# EAGLE schematic LedDriver (EAGLE 9.6.2)
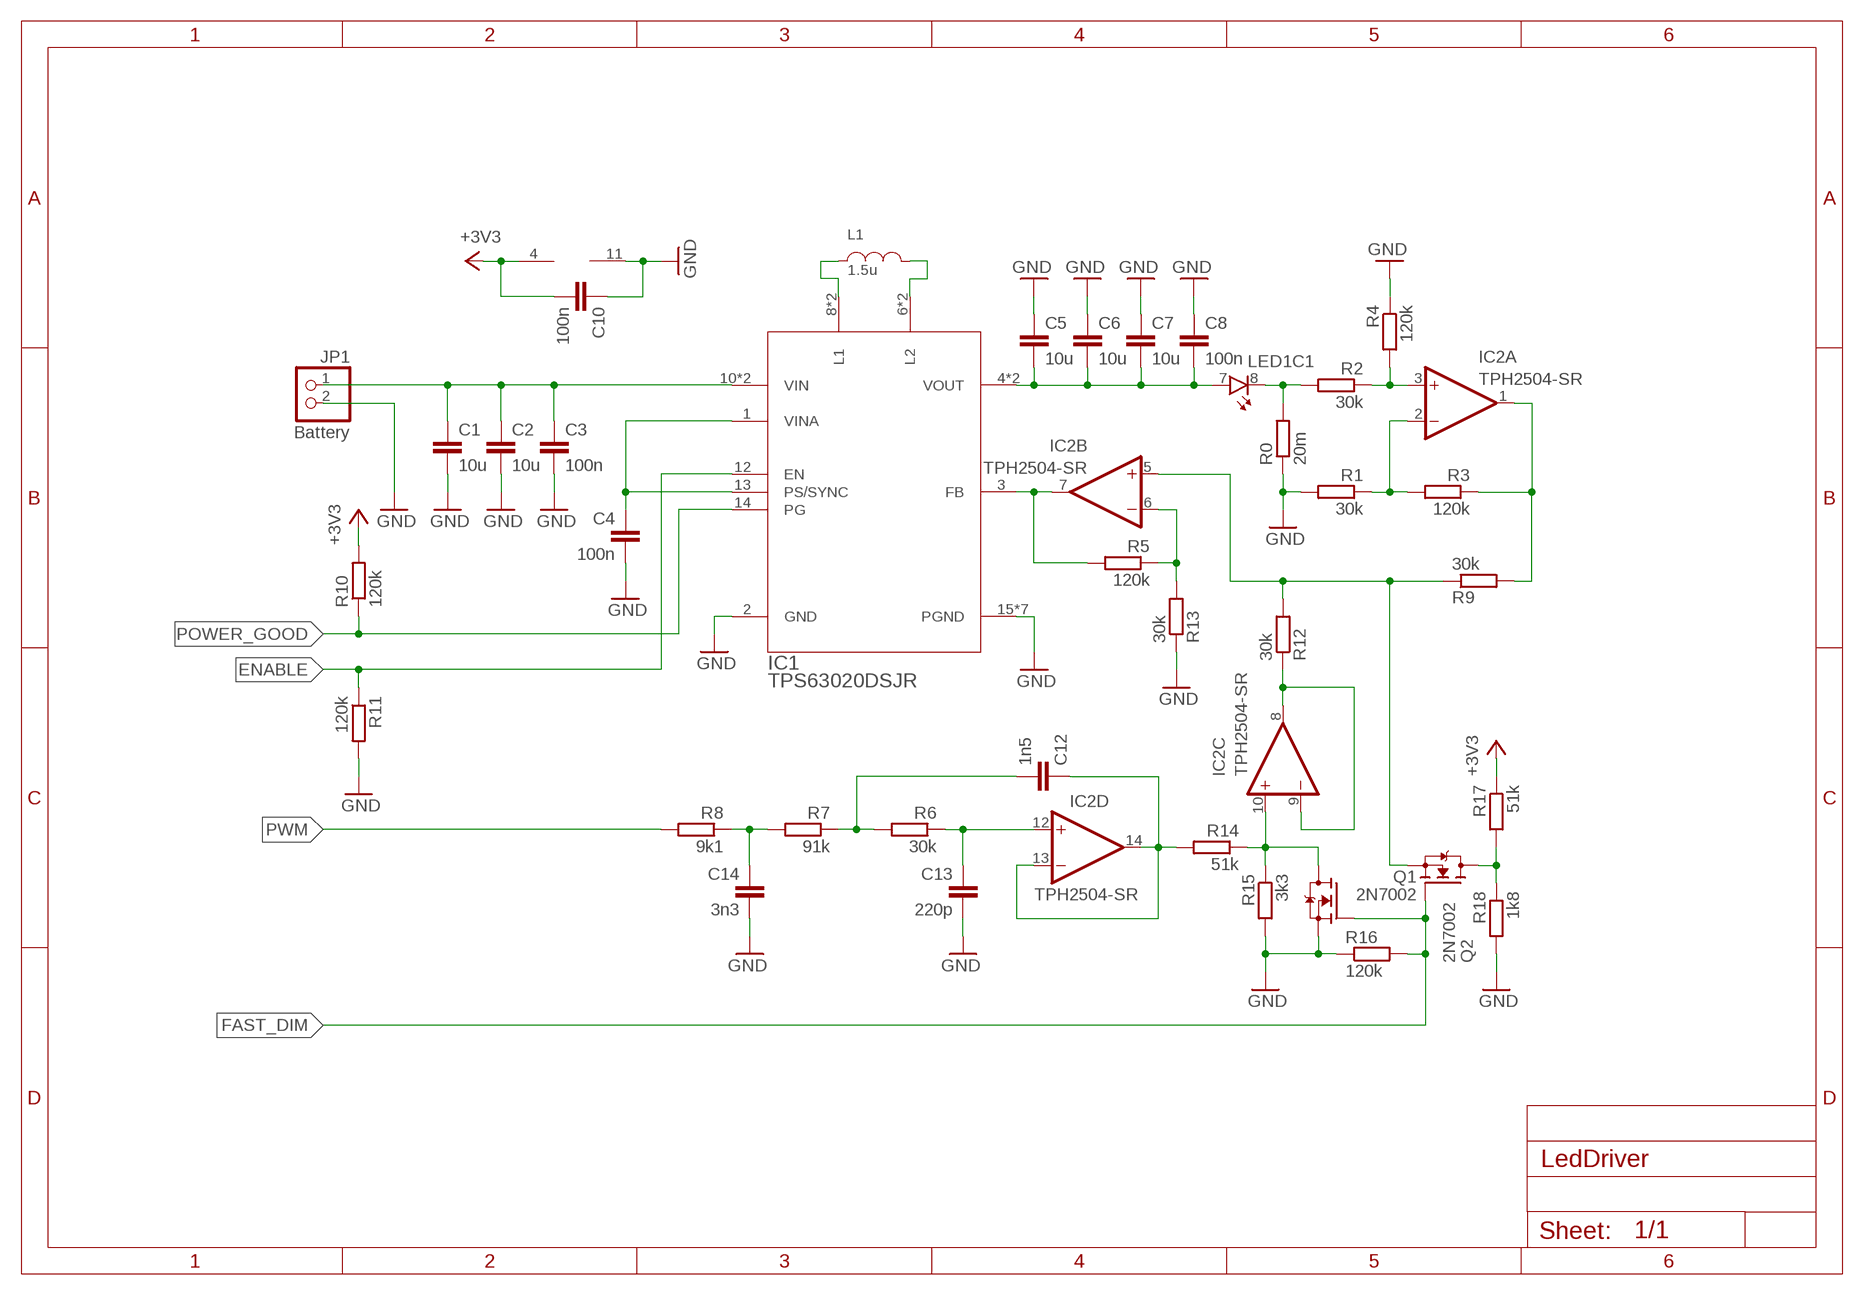
[diagram p0: schematic, sheet 1]

## Parts
C1  10u  C-EUC0603  [C0603]
C2  10u  C-EUC0603  [C0603]
C3  100n  C-EUC0603  [C0603]
C4  100n  C-EUC0603  [C0603]
C5  10u  C-EUC0603  [C0603]
C6  10u  C-EUC0603  [C0603]
C7  10u  C-EUC0603  [C0603]
C8  100n  C-EUC0603  [C0603]
C10  100n  C-EUC0603  [C0603]
C12  1n5  C-EUC0603  [C0603]
C13  220p  C-EUC0603  [C0603]
C14  3n3  C-EUC0603  [C0603]
IC1  TPS63020DSJR  [DSJ14_2P85X1P58]
IC2  TPH2504-SR  MCP604SL  [SO14]
JP1  Battery  PINHD-1X2  [1X02]
L1  1.5u  L5X5MM  [5X5MM]
LED1  ACULEDVHL-RGBY  [ACULEDVHL]
Q1  2N7002  N-MOSFET-SOT23-GSD  [SOT23]
Q2  2N7002  N-MOSFET-SOT23-GSD  [SOT23]
R0  20m  R-EU_R0805  [R0805]
R1  30k  R-EU_R0603  [R0603]
R2  30k  R-EU_R0603  [R0603]
R3  120k  R-EU_R0603  [R0603]
R4  120k  R-EU_R0603  [R0603]
R5  120k  R-EU_R0603  [R0603]
R6  30k  R-EU_R0603  [R0603]
R7  91k  R-EU_R0603  [R0603]
R8  9k1  R-EU_R0603  [R0603]
R9  30k  R-EU_R0603  [R0603]
R10  120k  R-EU_R0402  [R0402]
R11  120k  R-EU_R0402  [R0402]
R12  30k  R-EU_R0603  [R0603]
R13  30k  R-EU_R0603  [R0603]
R14  51k  R-EU_R0603  [R0603]
R15  3k3  R-EU_R0603  [R0603]
R16  120k  R-EU_R0402  [R0402]
R17  51k  R-EU_R0603  [R0603]
R18  1k8  R-EU_R0603  [R0603]

## Nets
+3V3: C10.2 IC2.4(P:V+) R10.2 R17.1
DRIVER_LOGIC_PWR: C4.1 IC1.1(VINA) IC1.13(PS/SYNC)
ENABLE: IC1.12(EN) R11.1
FAST_DIM: Q1.1(G) Q2.1(G) R16.2
FB: IC1.3(FB) IC2.7(B:OUT) R5.2
GND: C1.2 C2.2 C3.2 C4.2 C5.1 C6.1 C7.1 C8.1 C10.1 C13.2 C14.2 IC1.2(GND) IC1.15(PGND) IC1.V(PGND) IC1.V_1(PGND) IC1.V_2(PGND) IC1.V_3(PGND) IC1.V_4(PGND) IC1.V_5(PGND) IC2.11(P:V-) JP1.2 Q1.2(S) R0.1 R1.2 R4.1 R11.2 R13.1 R15.2 R16.1 R18.2
L1: IC1.8(L1) IC1.9(L1) L1.1
L2: IC1.6(L2) IC1.7(L2) L1.2
LED_A: LED1.8(C1:C) R0.2 R2.2
LED_C: C5.2 C6.2 C7.2 C8.2 IC1.4(VOUT) IC1.5(VOUT) LED1.7(C1:A)
N$1: IC2.3(A:+IN) R2.1 R4.2
N$2: C14.1 R7.2 R8.1
N$3: IC2.5(B:+IN) Q2.2(S) R9.1 R12.2
N$4: IC2.6(B:-IN) R5.1 R13.2
N$5: C12.2 R6.2 R7.1
N$6: IC2.1(A:OUT) R3.1 R9.2
N$7: C13.1 IC2.12(D:+IN) R6.1
N$8: C12.1 IC2.13(D:-IN) IC2.14(D:OUT) R14.2
N$9: IC2.10(C:+IN) Q1.3(D) R14.1 R15.1
N$10: IC2.8(C:OUT) IC2.9(C:-IN) R12.1
N$12: Q2.3(D) R17.2 R18.1
POWER_GOOD: IC1.14(PG) R10.1
PWM: R8.2
VA: IC2.2(A:-IN) R1.1 R3.2
VIN: C1.1 C2.1 C3.1 IC1.10(VIN) IC1.11(VIN) JP1.1
Unconnected: LED1.1(C4:A) LED1.2(C4:C) LED1.3(C3:A) LED1.4(C3:C) LED1.5(C2:A) LED1.6(C2:C)

## Library data of the parts
C1 C2 C5-C7 = rcl_upravena:C-EU: CAPACITOR, European symbol; LCSC: C96446
C3 C4 C8 C10 = rcl_upravena:C-EU: CAPACITOR, European symbol; LCSC: C14663
C12 = rcl_upravena:C-EU: CAPACITOR, European symbol; LCSC: C1595
C13 = rcl_upravena:C-EU: CAPACITOR, European symbol; LCSC: C1603
C14 = rcl_upravena:C-EU: CAPACITOR, European symbol; LCSC: C1613
IC1 = TPS63020:TPS63020DSJR; DATASHEET_URL: http://www.ti.com/lit/gpn/TPS63020; DESCRIPTION: High Efficiency Single Inductor Buck-Boost Converter with 4A Switch; FAMILY_NAME: BUCK-BOOST REGULATOR; GENERIC_PART_NUMBER: TPS63020; INDUSTRY_STD_PKG_TYPE: VSON; LCSC: C15483; MANUFACTURER: Texas Instruments; MANUFACTURER_PART_NUMBER: TPS63020DSJR; PACKAGE_DESIGNATOR: DSJ; PIN_COUNT: 14; VENDOR: Texas Instruments
IC2 = linear_upravena:MCP604: Quad Op Amp 2.7V to 6.0V Single Supply CMOS Source: http://ww1.microchip.com/downloads/en/DeviceDoc/21314g.pdf; LCSC: C115918
JP1 = pinhead:PINHD-1X2: PIN HEADER
L1 = inductors:L; LCSC: C408344
LED1 = led:ACULEDVHL: ACULED® VHL Standard Monochromatic and Multi-Colored Four-Chip LED Source: http://optoelectronics.perkinelmer.com/content/Datasheets/DTS_ACULEDVHL.pdf
Q1 Q2 = transistors:N-MOSFET; LCSC: C8545
R0 = rcl_upravena:R-EU_: RESISTOR, European symbol; LCSC: C92740
R1 R2 R6 R9 R12 R13 = rcl_upravena:R-EU_: RESISTOR, European symbol; LCSC: C22984
R3-R5 R10 R11 R16 = rcl_upravena:R-EU_: RESISTOR, European symbol; LCSC: C25808
R7 = rcl_upravena:R-EU_: RESISTOR, European symbol; LCSC: C23265
R8 = rcl_upravena:R-EU_: RESISTOR, European symbol; LCSC: C23260
R14 R17 = rcl_upravena:R-EU_: RESISTOR, European symbol; LCSC: C23196
R15 = rcl_upravena:R-EU_: RESISTOR, European symbol; LCSC: C22978
R18 = rcl_upravena:R-EU_: RESISTOR, European symbol; LCSC: C4177